# Altium project EEG_circuit.PrjPcb (part 2 of 3)
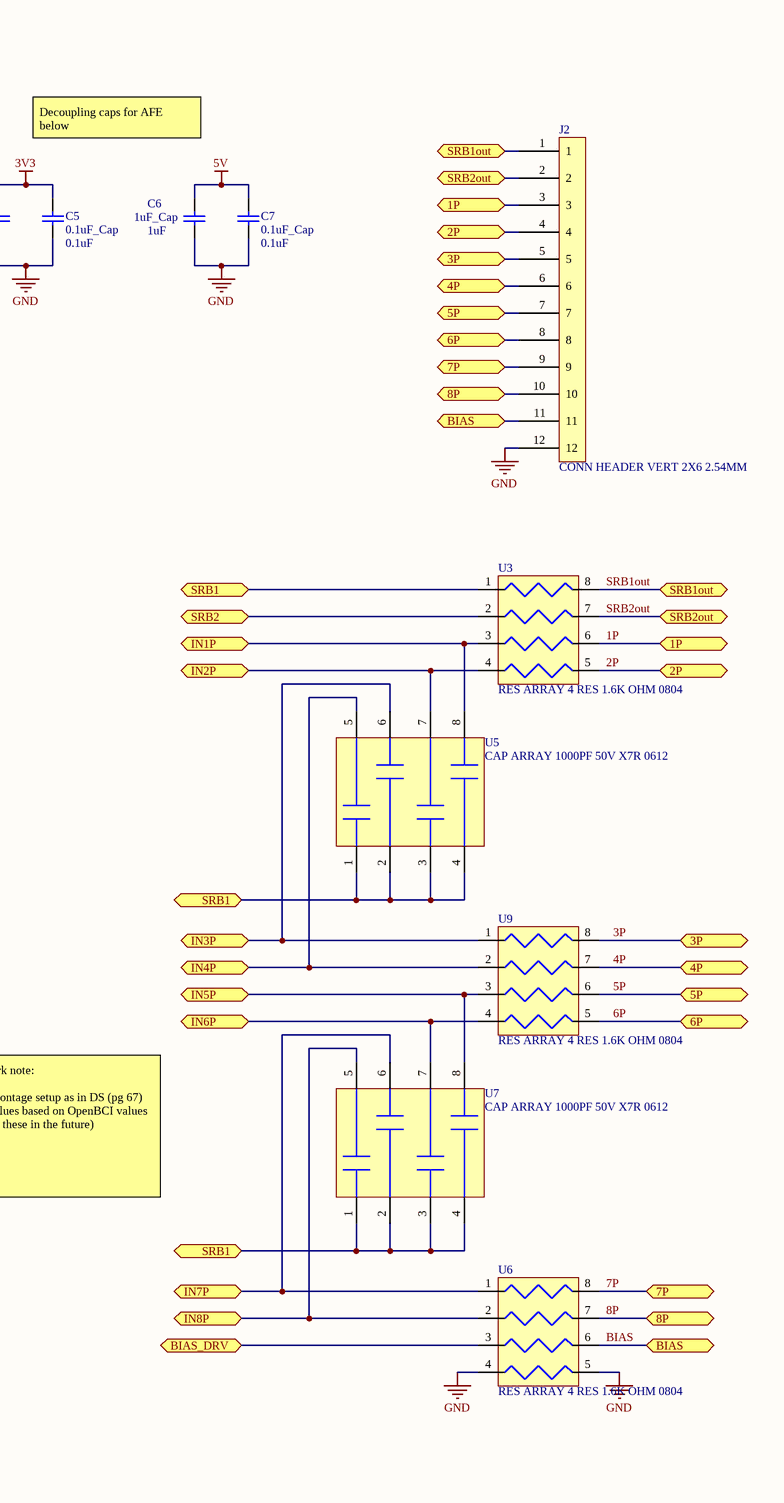
[diagram p2: EEG_schematic.SchDoc, right]

## Sheet EEG_schematic.SchDoc (continued)
### Library data of the parts
C1 C4 C6 C15 C16 = 1uF_Cap: 0402 Cap 1uF; Manufacturer: Murata; Manufacturer Part Number: GRM153R61A105ME95D; Material: Ceramic; Tolerance: 20%; Voltage Rating: 10V; Dielectric: X5R; Supplier 1: Digi-Key; Stock 1: 43822; Pricing 1: 1=0.19, 10=0.131, 100=0.0663, 500=0.04538, 1000=0.04015, 2500=0.0384, 5000=0.03491 (USD); Mount: Surface Mount; Case/Package: 0402; Weight: 0.000212oz; Case Code (Metric): 1005; Case Code (Imperial): 0402; Min Operating Temperature: -55°C; Max Operating Temperature: 85°C; Capacitance: 1uF; Packaging: Tape and Reel; Termination: SMD/SMT; Composition: Ceramic; Voltage Rating (DC): 10V; Package Quantity: 10000; Length: 1mm; Height: 0.3mm; Width: 0.5mm; Thickness: 0.013inch; REACH SVHC: No SVHC; ComponentLink1URL: http://www.farnell.com/datasheets/1666664.pdf?src-supplier=Element14; ComponentLink1Description: http://www.farnell.com/datasheets/1666664.pdf?src-supplier=Element14; Supplier Part Number 1: 490-14577-6-ND
C2 C5 C7 C10 C12 C18 = 0.1uF_Cap: 0402 Cap 0.1uF; Manufacturer: Samsung; Manufacturer Part Number: CL05A104KP5NNNC; Capacitance: 100nF; Tolerance: 10%; Voltage Rating: 10V; Dielectric: X5R; Supplier 1: Digi-Key; Stock 1: 12307534; Pricing 1: 1=0.1, 10=0.025, 100=0.0111, 500=0.00794, 1000=0.00624, 2500=0.00568, 5000=0.00522 (USD); Mount: Surface Mount; Case/Package: 0402; Case Code (Metric): 1005; Case Code (Imperial): 0402; Contact Plating: Tin; Min Operating Temperature: -55°C; Max Operating Temperature: 85°C; Packaging: Tape and Reel; Length: 1mm; Height: 0.5mm; Width: 0.02inch; Thickness: 0.022inch; Depth: 0.5mm; Radiation Hardening: No; ComponentLink1URL: https://media.digikey.com/pdf/Data%20Sheets/Samsung%20PDFs/CL_Series_MLCC_ds.pdf?src-supplier=Digi-Key; ComponentLink1Description: https://media.digikey.com/pdf/Data%20Sheets/Samsung%20PDFs/CL_Series_MLCC_ds.pdf?src-supplier=Digi-Key; ComponentLink2URL: https://www.verical.com/server-webapp/html/getDatasheet?partID=358611&src-supplier=Verical; ComponentLink2Description: https://www.verical.com/server-webapp/html/getDatasheet?partID=358611&src-supplier=Verical; ComponentLink3URL: http://www1.futureelectronics.com/doc/SAMSUNG%20PASSIVE/CL05B104KQ5NNNC.pdf?src-supplier=Future+Electronics; ComponentLink3Description: http://www1.futureelectronics.com/doc/SAMSUNG%20PASSIVE/CL05B104KQ5NNNC.pdf?src-supplier=Future+Electronics; ComponentLink4URL: https://www.distrelec.biz/Web/Downloads/_e/ng/MLCC_CatalogDownload2013_ENG.pdf?mime=application%2Fpdf&src-supplier=Distrelec; ComponentLink4Description: https://www.distrelec.biz/Web/Downloads/_e/ng/MLCC_CatalogDownload2013_ENG.pdf?mime=application%2Fpdf&src-supplier=Distrelec; Supplier Part Number 1: 1276-1022-6-ND
C3 = 1.5nF_Cap: 0402 Cap 1.5nF; Manufacturer: Samsung; Manufacturer Part Number: CL05B152KB5NNNC; Material: Ceramic; Tolerance: 10%; Voltage Rating: 50V; Dielectric: X7R; Supplier 1: Digi-Key; Stock 1: 658330; Pricing 1: 1=0.1, 10=0.023, 100=0.0101, 500=0.0072, 1000=0.00566, 2500=0.00514, 5000=0.00473 (USD); Mount: Surface Mount; Case/Package: 0402; Case Code (Metric): 1005; Case Code (Imperial): 0402; Contact Plating: Tin; Min Operating Temperature: -55°C; Max Operating Temperature: 125°C; Package Quantity: 1; Packaging: Tape and Reel; Capacitance: 1.5nF; Voltage: 50V; Length: 1mm; Height: 0.5mm; Width: 0.02inch; Thickness: 0.022inch; Depth: 0.5mm; Radiation Hardening: No; ComponentLink1URL: https://www.verical.com/server-webapp/html/getDatasheet?partID=543173&src-supplier=Verical; ComponentLink1Description: https://www.verical.com/server-webapp/html/getDatasheet?partID=543173&src-supplier=Verical; ComponentLink2URL: http://www1.futureelectronics.com/doc/SAMSUNG/CL05B152KB5NNNC.pdf?src-supplier=Future+Electronics; ComponentLink2Description: http://www1.futureelectronics.com/doc/SAMSUNG/CL05B152KB5NNNC.pdf?src-supplier=Future+Electronics; ComponentLink3URL: https://www.distrelec.biz/Web/Downloads/_e/ng/MLCC_CatalogDownload2013_ENG.pdf?mime=application%2Fpdf&src-supplier=Distrelec; ComponentLink3Description: https://www.distrelec.biz/Web/Downloads/_e/ng/MLCC_CatalogDownload2013_ENG.pdf?mime=application%2Fpdf&src-supplier=Distrelec; ComponentLink4URL: https://produktinfo.conrad.com/datenblaetter/450000-474999/459134-da-01-en-VS_KONDENSATOR_0402.pdf?src-supplier=Conrad; ComponentLink4Description: https://produktinfo.conrad.com/datenblaetter/450000-474999/459134-da-01-en-VS_KONDENSATOR_0402.pdf?src-supplier=Conrad; Supplier Part Number 1: 1276-1521-6-ND
C8 C13 C14 = 4.7uF_Cap: 0402 Cap 4.7uF; Manufacturer: Murata; Manufacturer Part Number: GRM155R61A475MEAAD; Tolerance: 20%; Voltage Rating: 10V; Supplier 1: Digi-Key; Stock 1: 848000; Pricing 1: 1=0.25, 10=0.169, 100=0.0856, 500=0.05854, 1000=0.05179, 2500=0.04954, 5000=0.04503 (USD); Mount: Surface Mount; Case/Package: 0402; Case Code (Imperial): 0402; Case Code (Metric): 1005; Min Operating Temperature: -55°C; Max Operating Temperature: 85°C; Packaging: Tape and Reel; Capacitance: 4.7uF; ComponentLink1URL: http://www.farnell.com/datasheets/2189109.pdf?src-supplier=Farnell; ComponentLink1Description: http://www.farnell.com/datasheets/2189109.pdf?src-supplier=Farnell; ComponentLink2URL: https://search.murata.co.jp/Ceramy/image/img/A01X/G101/ENG/GRM155R61A475MEAA-01.pdf?src-supplier=Digi-Key; ComponentLink2Description: https://search.murata.co.jp/Ceramy/image/img/A01X/G101/ENG/GRM155R61A475MEAA-01.pdf?src-supplier=Digi-Key; ComponentLink3URL: http://www.farnell.com/datasheets/2189109.pdf?src-supplier=Element14; ComponentLink3Description: http://www.farnell.com/datasheets/2189109.pdf?src-supplier=Element14; ComponentLink4URL: http://www.farnell.com/datasheets/2189109.pdf?src-supplier=Newark; ComponentLink4Description: http://www.farnell.com/datasheets/2189109.pdf?src-supplier=Newark; ComponentLink5URL: http://datasheet.octopart.com/GRM155R61A475MEAAD-Murata-datasheet-138740730.pdf?src-supplier=Ciiva+Crawler; ComponentLink5Description: http://datasheet.octopart.com/GRM155R61A475MEAAD-Murata-datasheet-138740730.pdf?src-supplier=Ciiva+Crawler; ComponentLink6URL: http://datasheet.octopart.com/GRM155R61A475MEAAD-Murata-datasheet-68589269.pdf?src-supplier=Newark; ComponentLink6Description: http://datasheet.octopart.com/GRM155R61A475MEAAD-Murata-datasheet-68589269.pdf?src-supplier=Newark; ComponentLink7URL: http://datasheet.octopart.com/GRM155R61A475MEAAD-Murata-datasheet-8819587.pdf; ComponentLink7Description: http://datasheet.octopart.com/GRM155R61A475MEAAD-Murata-datasheet-8819587.pdf; ComponentLink8URL: http://datasheet.octopart.com/GRM155R61A475MEAAD-Murata-datasheet-10025737.pdf; ComponentLink8Description: http://datasheet.octopart.com/GRM155R61A475MEAAD-Murata-datasheet-10025737.pdf; ComponentLink9URL: http://datasheet.octopart.com/GRM155R61A475MEAAD-Murata-datasheet-11978611.pdf; ComponentLink9Description: http://datasheet.octopart.com/GRM155R61A475MEAAD-Murata-datasheet-11978611.pdf; ComponentLink10URL: http://datasheet.octopart.com/GRM155R61A475MEAAD-Murata-datasheet-12510076.pdf; ComponentLink10Description: http://datasheet.octopart.com/GRM155R61A475MEAAD-Murata-datasheet-12510076.pdf; ComponentLink11URL: http://datasheet.octopart.com/GRM155R61A475MEAAD-Murata-datasheet-12515295.pdf; ComponentLink11Description: http://datasheet.octopart.com/GRM155R61A475MEAAD-Murata-datasheet-12515295.pdf; Supplier Part Number 1: 490-14306-6-ND
C9 C11 C17 C22 = 10uF_Cap: 0402 Cap 10uF; Manufacturer: Samsung; Manufacturer Part Number: CL05A106MP5NUNC; Tolerance: 20%; Voltage Rating: 10V; Dielectric: X5R; Supplier 1: Digi-Key; Stock 1: 3276370; Pricing 1: 1=0.42, 10=0.295, 100=0.1943, 500=0.14392, 1000=0.12233, 2500=0.11514, 5000=0.10794 (USD); Mount: Surface Mount; Case/Package: 0402; Case Code (Metric): 1005; Case Code (Imperial): 0402; Contact Plating: Tin; Min Operating Temperature: -55°C; Max Operating Temperature: 85°C; Package Quantity: 1; Packaging: Tape and Reel; Capacitance: 10uF; Termination: Wraparound; Length: 1mm; Width: 0.02inch; Thickness: 0.028inch; Depth: 0.5mm; Radiation Hardening: No; Lead Free: Lead Free; ComponentLink1URL: https://media.digikey.com/pdf/Data%20Sheets/Samsung%20PDFs/CL_Series_MLCC_ds.pdf?src-supplier=Digi-Key; ComponentLink1Description: https://media.digikey.com/pdf/Data%20Sheets/Samsung%20PDFs/CL_Series_MLCC_ds.pdf?src-supplier=Digi-Key; ComponentLink2URL: https://www.verical.com/server-webapp/html/getDatasheet?partID=745310&src-supplier=Verical; ComponentLink2Description: https://www.verical.com/server-webapp/html/getDatasheet?partID=745310&src-supplier=Verical; Supplier Part Number 1: 1276-1450-6-ND
C19 C23 = 100uF_Cap: 1206 Cap 100uF; Manufacturer: Murata; Manufacturer Part Number: GRM31CR60J107ME39L; Material: Ceramic; Tolerance: 20%; Voltage Rating: 6.3V; Dielectric: X5R; Supplier 1: Digi-Key; Stock 1: 1307168; Pricing 1: 1=1.08, 10=0.852, 100=0.6386, 500=0.48254, 1000=0.42577 (USD); Mount: Surface Mount; Case/Package: 1206; Case Code (Imperial): 1206; Case Code (Metric): 3216; Min Operating Temperature: -55°C; Max Operating Temperature: 85°C; Capacitance: 100uF; Packaging: Tape and Reel; Voltage Rating (DC): 6.3V; Package Quantity: 1; Termination: SMD/SMT; Voltage: 6.3V; Length: 3.2mm; Height: 1.6mm; Width: 1.6mm; Thickness: 0.071inch; Depth: 1.6mm; Radiation Hardening: No; REACH SVHC: No SVHC; Lead Free: Lead Free; ComponentLink1URL: http://uk.rs-online.com/webdocs/1388/0900766b813885c5.pdf?src-supplier=RSComponents; ComponentLink1Description: http://uk.rs-online.com/webdocs/1388/0900766b813885c5.pdf?src-supplier=RSComponents; ComponentLink2URL: http://components.arrow.com/part/dataview/42788059S8888100N2606?src-supplier=Arrow; ComponentLink2Description: http://components.arrow.com/part/dataview/42788059S8888100N2606?src-supplier=Arrow; ComponentLink3URL: http://www.mouser.com/ds/2/281/c02e-2905.pdf?src-supplier=Mouser; ComponentLink3Description: http://www.mouser.com/ds/2/281/c02e-2905.pdf?src-supplier=Mouser; ComponentLink4URL: https://www.murata.com/~/media/webrenewal/support/library/catalog/products/capacitor/mlcc/c02e.ashx?la=en-us&src-supplier=Digi-Key; ComponentLink4Description: https://www.murata.com/~/media/webrenewal/support/library/catalog/products/capacitor/mlcc/c02e.ashx?la=en-us&src-supplier=Digi-Key; ComponentLink5URL: http://psearch.murata.com/capacitor/product/GRM31CF51A226ZE01%23.pdf?src-supplier=Future+Electronics; ComponentLink5Description: http://psearch.murata.com/capacitor/product/GRM31CF51A226ZE01%23.pdf?src-supplier=Future+Electronics; ComponentLink6URL: https://www.distrelec.biz/Web/Downloads/_t/ds/murata_MLCC_eng_tds.pdf?mime=application%2Fpdf&src-supplier=Distrelec; ComponentLink6Description: https://www.distrelec.biz/Web/Downloads/_t/ds/murata_MLCC_eng_tds.pdf?mime=application%2Fpdf&src-supplier=Distrelec; ComponentLink7URL: http://www.produktinfo.conrad.com/datenblaetter/450000-474999/454804-da-01-en-VS_KONDENSATOR_1206.pdf?src-supplier=Conrad; ComponentLink7Description: http://www.produktinfo.conrad.com/datenblaetter/450000-474999/454804-da-01-en-VS_KONDENSATOR_1206.pdf?src-supplier=Conrad; ComponentLink8URL: http://www.produktinfo.conrad.com/datenblaetter/450000-474999/451152-da-01-de-VS_CHIP_KOND_1206_100_0_UF_20Pr_6_3V_X5R.pdf?src-supplier=Conrad; ComponentLink8Description: http://www.produktinfo.conrad.com/datenblaetter/450000-474999/451152-da-01-de-VS_CHIP_KOND_1206_100_0_UF_20Pr_6_3V_X5R.pdf?src-supplier=Conrad; Supplier Part Number 1: 490-4539-6-ND
C20 C21 = 18pF_Cap: 0402 Cap 18pF; Manufacturer: KEMET; Manufacturer Part Number: C0402C180K5RAC7867; Supplier 1: Digi-Key; Stock 1: 3569; Pricing 1: 1=0.21, 10=0.142, 100=0.0721, 500=0.04934, 1000=0.04364, 2500=0.04174, 5000=0.03795 (USD); Supplier Part Number 1: 399-19371-6-ND; ComponentLink1Description: digikey link; ComponentLink1URL: https://www.digikey.ca/product-detail/en/kemet/C0402C180K5RAC7867/399-19371-1-ND/9694278
D1 = GSOT04C-G3-08: TVS Diode Arrays 4.0 Volt 300 Watt Common Anode; Manufacturer: Vishay Semiconductors; Capacitance: 200pF; Polarity: Bidirectional; Number of Channels: 2; Breakdown Voltage: 6.1V; Clamping Voltage: 14.3V; Peak Pulse Power: 429W; Reverse Standoff Voltage: 4V; Min Breakdown Voltage: 5V; Power Line Protection: No; Peak Pulse Current: 30A; Supplier 1: Digi-Key; Manufacturer Part Number: GSOT04C-G3-08; Stock 1: 3725; Pricing 1: 1=0.43, 10=0.324, 25=0.2916, 100=0.1538, 250=0.15224, 500=0.13634, 1000=0.1061 (USD); Mount: Surface Mount; Case/Package: TO-236-3; Weight: 0.00031oz; Min Operating Temperature: -55°C; Max Operating Temperature: 150°C; Packaging: Tape and Reel; Termination: SMD/SMT; Number of Unidirectional Channels: 2; Composition: Zener; ComponentLink1URL: http://www.mouser.com/ds/2/427/gsot03c-243311.pdf?src-supplier=Mouser; ComponentLink1Description: http://www.mouser.com/ds/2/427/gsot03c-243311.pdf?src-supplier=Mouser; ComponentLink2URL: http://www.vishay.com/docs/85824/gsot03c.pdf?src-supplier=Digi-Key; ComponentLink2Description: http://www.vishay.com/docs/85824/gsot03c.pdf?src-supplier=Digi-Key; Supplier Part Number 1: GSOT04C-G3-08GIDKR-ND
D2 = LED1: LED BLUE CLEAR CHIP SMD; Manufacturer: Vishay Lite-On; Manufacturer Part Number: LTST-C193TBKT-5A; Lens Color: Colorless; Forward Current: 20mA; Forward Voltage: 2.8V; Luminous Intensity: 15mcd; Viewing Angle: 130°; Lens Style: Diffused,Colorless,Rectangular,Clear; Dominant Wavelength: 475nm; Test Current: 5mA; Number of Elements: 1; Power Dissipation: 76mW; Reverse Voltage: 5V; Published: 8-Jun-2000; LatestRevisionDate: 08-Jul-2005; LatestRevisionNote: Mech Layer 1 removed.; PackageReference: LED-1; Publisher: Altium Limited; PackageDescription: LED; 2 Leads; Supplier 1: Digi-Key; Supplier Part Number 1: 160-1827-1-ND; Stock 1: 40029; Pricing 1: 1=0.45, 10=0.32, 100=0.1424, 500=0.09968, 1000=0.08188, 2500=0.0712 (USD); Mount: Surface Mount; Case/Package: 0603; Number of Pins: 2; Color: Blue; Case Code (Metric): 1608; Case Code (Imperial): 0603; Min Operating Temperature: -20°C; Max Operating Temperature: 80°C; Packaging: Tape and Reel; Package Quantity: 1; Illumination Color: Blue; Lens Transparency: Clear; Number of LEDs: 1; Length: 1.6mm; Height: 0.35mm; Width: 0.8mm; Depth: 0.8mm; Radiation Hardening: No; Lead Free: Lead Free; ComponentLink1URL: http://www.mouser.com/ds/2/239/Lite-On-LTST-C193TBKT-5A-187386.pdf?src-supplier=Mouser; ComponentLink1Description: http://www.mouser.com/ds/2/239/Lite-On-LTST-C193TBKT-5A-187386.pdf?src-supplier=Mouser; ComponentLink2URL: https://media.digikey.com/pdf/Data%20Sheets/Lite-On%20PDFs/LTST-C193TBKT-5A.pdf?src-supplier=Digi-Key; ComponentLink2Description: https://media.digikey.com/pdf/Data%20Sheets/Lite-On%20PDFs/LTST-C193TBKT-5A.pdf?src-supplier=Digi-Key; ComponentLink3URL: https://www.verical.com/server-webapp/html/getDatasheet?partID=293056&src-supplier=Verical; ComponentLink3Description: https://www.verical.com/server-webapp/html/getDatasheet?partID=293056&src-supplier=Verical; ComponentLink4URL: http://uk.rs-online.com/webdocs/0dc0/0900766b80dc0554.pdf?src-supplier=RSComponents; ComponentLink4Description: http://uk.rs-online.com/webdocs/0dc0/0900766b80dc0554.pdf?src-supplier=RSComponents; ComponentLink5URL: http://www1.futureelectronics.com/doc/LITE-ON/LTST-C193TBKT-5A.pdf?src-supplier=Future+Electronics; ComponentLink5Description: http://www1.futureelectronics.com/doc/LITE-ON/LTST-C193TBKT-5A.pdf?src-supplier=Future+Electronics
J1 = B2B-PH-SM4-TBT(LF)(SN): Manufacturer: JST; Number of Positions: 2; Connector Type: Male Pin; Pitch: 0.079inch; Supplier 1: Digi-Key; Manufacturer Part Number: B2B-PH-SM4-TBT(LF)(SN); Stock 1: 6672; Pricing 1: 1=0.82, 10=0.768, 100=0.5888, 500=0.51202 (USD); Mount: Surface Mount; Color: Natural; Contact Plating: Tin; Packaging: Cut Tape; Number of Rows: 1; Package Quantity: 1; Fastening Type: Detent; Termination: Solder; Contact Mating Length: 0.13inch; Lead Free: Lead Free; ComponentLink1URL: https://www.verical.com/server-webapp/html/getDatasheet?partID=473167&src-supplier=Verical; ComponentLink1Description: https://www.verical.com/server-webapp/html/getDatasheet?partID=473167&src-supplier=Verical; ComponentLink2URL: http://www.jst-mfg.com/product/pdf/eng/ePH.pdf?src-supplier=Digi-Key; ComponentLink2Description: http://www.jst-mfg.com/product/pdf/eng/ePH.pdf?src-supplier=Digi-Key; Supplier Part Number 1: 455-2872-6-ND
J2 = 61301211121: WURTH ELEKTRONIK         61301211121            Board-To-Board Connector, Vertical, WR-PHD Series, Through Hole, Header, 12 Contacts, 2.54 mm; Manufacturer: Wurth Electronics; Number of Positions: 12; Gender: Male; Connector Type: Male Pin; Pitch: 0.1inch; Supplier 1: Digi-Key; Manufacturer Part Number: 61301211121; Stock 1: 334; Pricing 1: 1=0.54, 10=0.454, 25=0.3792, 50=0.316, 100=0.287, 1000=0.261 (USD); Mount: Through Hole; Contact Plating: Gold; Contact Material: Copper; Color: Black; Number of Rows: 1; Packaging: Bulk; Termination: Solder; Number of Contacts: 12; Contact Mating Length: 0.236inch; REACH SVHC: Unknown; ComponentLink1URL: http://www.farnell.com/cad/1737268.pdf?src-supplier=Element14; ComponentLink1Description: http://www.farnell.com/cad/1737268.pdf?src-supplier=Element14; ComponentLink2URL: https://katalog.we-online.de/em/datasheet/6130xx11121.pdf?src-supplier=Digi-Key; ComponentLink2Description: https://katalog.we-online.de/em/datasheet/6130xx11121.pdf?src-supplier=Digi-Key; Supplier Part Number 1: 732-5323-ND
J3 = MEM2067-02-180-00-A: GLOBAL CONNECTOR TECHNOLOGY         MEM2067-02-180-00-A             MEMORY CARD CONNECTOR, 8 POSITION; Number of Contacts: 8; Supplier 1: Digi-Key; Manufacturer: Global Connector Technology; Manufacturer Part Number: MEM2067-02-180-00-A; Stock 1: 0; Mount: Socket; Contact Material: Copper Alloy; Contact Plating: Gold; REACH SVHC: No SVHC; Lead Free: Lead Free; ComponentLink1URL: http://www.farnell.com/datasheets/1876941.pdf?src-supplier=Element14; ComponentLink1Description: http://www.farnell.com/datasheets/1876941.pdf?src-supplier=Element14; ComponentLink2URL: http://www.farnell.com/datasheets/1876941.pdf?src-supplier=Farnell; ComponentLink2Description: http://www.farnell.com/datasheets/1876941.pdf?src-supplier=Farnell; Supplier Part Number 1: 2073-MEM2067-02-180-00-ACT-ND
J4 = 61300621121: WURTH ELEKTRONIK         61300621121            Board-To-Board Connector, Vertical, WR-PHD Series, Through Hole, Header, 6 Contacts, 2.54 mm; Manufacturer: Wurth Electronics; Number of Positions: 6; Gender: Male; Connector Type: Male Pin; Pitch: 0.1inch; Supplier 1: Digi-Key; Manufacturer Part Number: 61300621121; Stock 1: 2655; Pricing 1: 1=0.54, 10=0.454, 25=0.3792, 50=0.316, 100=0.287, 1000=0.261 (USD); Mount: Through Hole; Contact Plating: Gold; Contact Material: Copper; Color: Black; Number of Rows: 2; Packaging: Bulk; Termination: Solder; Number of Contacts: 6; Row Spacing: 0.1inch; Contact Mating Length: 0.236inch; REACH SVHC: Unknown; ComponentLink1URL: http://www.farnell.com/datasheets/1442180.pdf?src-supplier=Element14; ComponentLink1Description: http://www.farnell.com/datasheets/1442180.pdf?src-supplier=Element14; Supplier Part Number 1: 732-5295-ND
L1 = 2_2uH_Inductor: FIXED IND 2.2UH 500MA 250 MOHM; Manufacturer: TDK; Manufacturer Part Number: MLZ1608A2R2WT000; Core Material: Ferrite; Tolerance: 20%; Saturation Current: 130mA; Shielding: Shielded; DC Resistance (DCR): 325mR; Self Resonant Frequency: 120MHz; Test Frequency: 10MHz; Supplier 1: Digi-Key; Stock 1: 11492; Pricing 1: 1=0.17, 10=0.155, 100=0.1035, 500=0.08626, 1000=0.07245 (USD); Mount: Surface Mount; Case/Package: 0603; Case Code (Metric): 1608; Case Code (Imperial): 0603; Min Operating Temperature: -55°C; Max Operating Temperature: 125°C; Package Quantity: 4000; Packaging: Tape and Reel; Current Rating: 500mA; Inductance: 2.2uH; Length: 0.063inch; Width: 0.031inch; Height - Seated (Max): 0.037inch; Lead Free: Lead Free; ComponentLink1URL: https://product.tdk.com/info/en/catalog/datasheets/inductor_commercial_decoupling_mlz1608_en.pdf?src-supplier=Digi-Key; ComponentLink1Description: https://product.tdk.com/info/en/catalog/datasheets/inductor_commercial_decoupling_mlz1608_en.pdf?src-supplier=Digi-Key; Supplier Part Number 1: 445-6385-6-ND
L2 = 4_7uH_Inductor: Inductor; Manufacturer: TDK; Manufacturer Part Number: MLZ1608M4R7WT000; Core Material: Ferrite; Tolerance: 20%; Current Rating: 350mA; Saturation Current: 120mA; Shielding: Shielded; DC Resistance (DCR): 650mR; Test Frequency: 2MHz; Self Resonant Frequency: 80MHz; Supplier 1: Digi-Key; Stock 1: 1557; Pricing 1: 1=0.17, 10=0.155, 100=0.1035, 500=0.08626, 1000=0.07245 (USD); Mount: Surface Mount; Case/Package: 0603; Case Code (Metric): 1608; Case Code (Imperial): 0603; Min Operating Temperature: -55°C; Max Operating Temperature: 125°C; Package Quantity: 4000; Packaging: Tape and Reel; Inductance: 4.7uH; Length: 0.063inch; Width: 0.031inch; Height - Seated (Max): 0.037inch; ComponentLink1URL: https://product.tdk.com/info/en/catalog/datasheets/inductor_commercial_decoupling_mlz1608_en.pdf?src-supplier=Digi-Key; ComponentLink1Description: https://product.tdk.com/info/en/catalog/datasheets/inductor_commercial_decoupling_mlz1608_en.pdf?src-supplier=Digi-Key; Supplier Part Number 1: 445-6390-6-ND
R1 R16 = 1M_Res: RES SMD 1M OHM 1% 1/16W 0402; Manufacturer: Yageo; Manufacturer Part Number: RC0402FR-071ML; Resistance: 1MR; Power Rating: 63mW; Voltage Rating: 50V; Temperature Coefficient: 100ppm/°C; Supplier 1: Digi-Key; Stock 1: 10014545; Pricing 1: 1=0.1, 10=0.016, 100=0.0064, 1000=0.00289, 2500=0.00251, 5000=0.00207 (USD); Case/Package: 0402; Case Code (Imperial): 0402; Case Code (Metric): 1005; Min Operating Temperature: -55°C; Max Operating Temperature: 155°C; Packaging: Tape and Reel; Tolerance: 1%; Termination: SMD/SMT; Composition: Thick Film; Military Standard: Not; Length: 1mm; Height: 0.32mm; Depth: 0.5mm; REACH SVHC: Unknown; Lead Free: Lead Free; ComponentLink1URL: http://www.farnell.com/datasheets/1018594.pdf?src-supplier=Element14; ComponentLink1Description: http://www.farnell.com/datasheets/1018594.pdf?src-supplier=Element14; ComponentLink2URL: http://www.yageo.com/documents/recent/PYu-RC0402_51_RoHS_L_6_r.pdf?src-supplier=Future+Electronics; ComponentLink2Description: http://www.yageo.com/documents/recent/PYu-RC0402_51_RoHS_L_6_r.pdf?src-supplier=Future+Electronics; ComponentLink3URL: http://www.farnell.com/datasheets/2167052.pdf?src-supplier=Element14; ComponentLink3Description: http://www.farnell.com/datasheets/2167052.pdf?src-supplier=Element14; Supplier Part Number 1: 311-1.00MLRCT-ND
R2 R3 = 0_Res: RES SMD 0 OHM JUMPER 1/16W 0402; Manufacturer: Yageo; Manufacturer Part Number: RC0402JR-070RL; Resistance: 0mR; Power Rating: 62.5mW; Tolerance: 5%; Voltage Rating: 50V; Max Power Dissipation: 63mW; Temperature Coefficient: 200ppm/°C; Supplier 1: Digi-Key; Stock 1: 50001357; Pricing 1: 1=0.1, 10=0.013, 25=0.0092, 50=0.0072, 100=0.0053, 250=0.004, 500=0.0032, 1000=0.00236, 5000=0.00169 (USD); Case/Package: 0402; Contact Plating: Tin,Matte; Case Code (Metric): 1005; Case Code (Imperial): 0402; Min Operating Temperature: -55°C; Max Operating Temperature: 155°C; Packaging: Tape and Reel; Composition: Thick Film; Package Quantity: 1; Number of Terminations: 2; Termination: SMD/SMT; Military Standard: Not; Features: Moisture Resistant; Length: 1mm; Height: 0.016inch; Width: 0.02inch; Depth: 0.5mm; Radiation Hardening: No; REACH SVHC: Unknown; Lead Free: Lead Free; ComponentLink1URL: http://www.yageo.com/documents/recent/PYu-RC_Group_51_RoHS_L_10.pdf?src-supplier=Digi-Key; ComponentLink1Description: http://www.yageo.com/documents/recent/PYu-RC_Group_51_RoHS_L_10.pdf?src-supplier=Digi-Key; ComponentLink2URL: http://www.yageo.com/documents/recent/PYu-RC0402_51_RoHS_L_6.pdf?src-supplier=Avnet+Europe; ComponentLink2Description: http://www.yageo.com/documents/recent/PYu-RC0402_51_RoHS_L_6.pdf?src-supplier=Avnet+Europe; ComponentLink3URL: http://www.farnell.com/datasheets/1018594.pdf?src-supplier=Element14; ComponentLink3Description: http://www.farnell.com/datasheets/1018594.pdf?src-supplier=Element14; ComponentLink4URL: https://www.verical.com/server-webapp/html/getDatasheet?partID=326379&src-supplier=Verical; ComponentLink4Description: https://www.verical.com/server-webapp/html/getDatasheet?partID=326379&src-supplier=Verical; ComponentLink5URL: http://www.farnell.com/datasheets/2167052.pdf?src-supplier=Element14; ComponentLink5Description: http://www.farnell.com/datasheets/2167052.pdf?src-supplier=Element14; Supplier Part Number 1: 311-0.0JRDKR-ND
R4 = 453k_Res: RES SMD 453K OHM 1% 1/16W 0402; Manufacturer: Yageo; Manufacturer Part Number: RC0402FR-07453KL; Resistance: 453kR; Power Rating: 62.5mW; Voltage Rating: 50V; Max Power Dissipation: 63mW; Temperature Coefficient: 100ppm/°C; Supplier 1: Digi-Key; Stock 1: 641723; Pricing 1: 1=0.1, 10=0.016, 100=0.0064, 1000=0.00289, 2500=0.00251, 5000=0.00207 (USD); Case/Package: 0402; Case Code (Imperial): 0402; Case Code (Metric): 1005; Contact Plating: Tin,Matte; Min Operating Temperature: -55°C; Max Operating Temperature: 155°C; Tolerance: 1%; Packaging: Tape and Reel; Composition: Thick Film; Number of Terminations: 2; Termination: SMD/SMT; Military Standard: Not; Voltage Rating (DC): 50V; Features: Moisture Resistant; Length: 1mm; Height: 0.016inch; Width: 0.02inch; Depth: 0.5mm; Lead Free: Lead Free; ComponentLink1URL: http://www.yageo.com/documents/recent/PYu-RC0402_51_RoHS_L_6_r.pdf?src-supplier=Future+Electronics; ComponentLink1Description: http://www.yageo.com/documents/recent/PYu-RC0402_51_RoHS_L_6_r.pdf?src-supplier=Future+Electronics; ComponentLink2URL: https://www.verical.com/server-webapp/html/getDatasheet?partID=325135&src-supplier=Verical; ComponentLink2Description: https://www.verical.com/server-webapp/html/getDatasheet?partID=325135&src-supplier=Verical; ComponentLink3URL: http://www.yageo.com/documents/recent/PYu-RC0402_51_RoHS_L_6.pdf?src-supplier=Avnet; ComponentLink3Description: http://www.yageo.com/documents/recent/PYu-RC0402_51_RoHS_L_6.pdf?src-supplier=Avnet; ComponentLink4URL: http://www.yageo.com/documents/recent/PYu-RC0402_51_RoHS_L_6.pdf?src-supplier=Avnet+Europe; ComponentLink4Description: http://www.yageo.com/documents/recent/PYu-RC0402_51_RoHS_L_6.pdf?src-supplier=Avnet+Europe; Supplier Part Number 1: YAG3164DKR-ND
R5-R8 R11 = 100k_Res: RES SMD 100K OHM 1% 1/16W 0402; Manufacturer: Yageo; Manufacturer Part Number: RC0402FR-07100KL; Resistance: 100kR; Temperature Coefficient: 100ppm/°C; Power Rating: 63mW; Voltage Rating: 50V; Published: 8-Jun-2000; LatestRevisionDate: 17-Jul-2002; LatestRevisionNote: Re-released for DXP Platform.; PackageReference: AXIAL-0.3; Publisher: Altium Limited; PackageDescription: Axial Device, Thru-Hole; 2 Leads; 0.3 in Pin Spacing; Supplier 1: Digi-Key; Stock 1: 46714463; Pricing 1: 1=0.1, 10=0.016, 100=0.0064, 1000=0.00289, 2500=0.00251, 5000=0.00207 (USD); Case/Package: 0402; Case Code (Metric): 1005; Case Code (Imperial): 0402; Min Operating Temperature: -55°C; Max Operating Temperature: 155°C; Tolerance: 1%; Packaging: Tape and Reel; Composition: Thick Film; Termination: SMD/SMT; Military Standard: Not; Number of Terminations: 2; Working Voltage: 50V; Package Quantity: 1; Max Power Dissipation: 63mW; Features: Moisture Resistant; Length: 0.039inch; Height: 0.016inch; Width: 0.02inch; Depth: 0.5mm; REACH SVHC: No SVHC; Lead Free: Lead Free; ComponentLink1URL: http://www.yageo.com/documents/recent/PYu-RC_Group_51_RoHS_L_10.pdf?src-supplier=Digi-Key; ComponentLink1Description: http://www.yageo.com/documents/recent/PYu-RC_Group_51_RoHS_L_10.pdf?src-supplier=Digi-Key; ComponentLink2URL: http://www.farnell.com/datasheets/1018594.pdf?src-supplier=Element14; ComponentLink2Description: http://www.farnell.com/datasheets/1018594.pdf?src-supplier=Element14; ComponentLink3URL: http://www.yageo.com/documents/recent/PYu-RC_Group_51_RoHS_L_9.pdf?src-supplier=Verical; ComponentLink3Description: http://www.yageo.com/documents/recent/PYu-RC_Group_51_RoHS_L_9.pdf?src-supplier=Verical; ComponentLink4URL: http://www.yageo.com/documents/recent/PYu-RC_Group_51_RoHS_L_9.pdf?src-supplier=Mouser; ComponentLink4Description: http://www.yageo.com/documents/recent/PYu-RC_Group_51_RoHS_L_9.pdf?src-supplier=Mouser; ComponentLink5URL: http://documents.rs-components.com/techlib://itc_doclist_GB.htm?stockno=6185797&src-supplier=RSComponents; ComponentLink5Description: http://documents.rs-components.com/techlib://itc_doclist_GB.htm?stockno=6185797&src-supplier=RSComponents; Supplier Part Number 1: 311-100KLRCT-ND
R9 = 1_6M_Res: RES SMD 1.6M OHM 5% 1/16W 0402; Manufacturer: Yageo; Manufacturer Part Number: RC0402JR-071M6L; Resistance: 1.6MR; Max Power Dissipation: 63mW; Temperature Coefficient: 100ppm/°C; Supplier 1: Digi-Key; Stock 1: 10969; Pricing 1: 1=0.1, 10=0.013, 100=0.0053, 1000=0.00236, 2500=0.00205, 5000=0.00169 (USD); Case/Package: 0402; Case Code (Metric): 1005; Case Code (Imperial): 0402; Contact Plating: Tin,Matte; Min Operating Temperature: -55°C; Max Operating Temperature: 155°C; Tolerance: 5%; Packaging: Tape and Reel; Composition: Thick Film; Number of Terminations: 2; Military Standard: Not; Features: Moisture Resistant; Length: 0.039inch; Height: 0.016inch; Width: 0.02inch; Depth: 0.5mm; Radiation Hardening: No; ComponentLink1URL: http://www.yageo.com/documents/recent/PYu-RC0402_51_RoHS_L_6.pdf?src-supplier=Avnet; ComponentLink1Description: http://www.yageo.com/documents/recent/PYu-RC0402_51_RoHS_L_6.pdf?src-supplier=Avnet; ComponentLink2URL: http://www.yageo.com/documents/recent/PYu-RC0402_51_RoHS_L_6.pdf?src-supplier=Avnet+Europe; ComponentLink2Description: http://www.yageo.com/documents/recent/PYu-RC0402_51_RoHS_L_6.pdf?src-supplier=Avnet+Europe; Supplier Part Number 1: YAG3284DKR-ND
R10 = 180k_Res: RES SMD 180K OHM 5% 1/16W 0402; Manufacturer: Yageo; Manufacturer Part Number: RC0402JR-07180KL; Resistance: 180kR; Power Rating: 63mW; Voltage Rating: 50V; Temperature Coefficient: 100ppm/°C; Supplier 1: Digi-Key; Stock 1: 33910; Pricing 1: 1=0.1, 10=0.013, 100=0.0053, 1000=0.00236, 2500=0.00205, 5000=0.00169 (USD); Case/Package: 0402; Number of Pins: 2; Case Code (Imperial): 0402; Case Code (Metric): 1005; Min Operating Temperature: -55°C; Max Operating Temperature: 155°C; Tolerance: 5%; Voltage Rating (DC): 50V; Packaging: Tape and Reel; Package Quantity: 1; Termination: SMD/SMT; Composition: Thick Film; Number of Terminations: 2; Military Standard: Not; Max Power Dissipation: 63mW; Features: Moisture Resistant; Length: 1mm; Height: 0.016inch; Width: 0.5mm; Depth: 0.5mm; REACH SVHC: Unknown; Lead Free: Lead Free; ComponentLink1URL: http://www.farnell.com/datasheets/1018594.pdf?src-supplier=Farnell; ComponentLink1Description: http://www.farnell.com/datasheets/1018594.pdf?src-supplier=Farnell; ComponentLink2URL: http://www.yageo.com/documents/recent/PYu-RC0402_51_RoHS_L_6_r.pdf?src-supplier=Future+Electronics; ComponentLink2Description: http://www.yageo.com/documents/recent/PYu-RC0402_51_RoHS_L_6_r.pdf?src-supplier=Future+Electronics; ComponentLink3URL: http://www.farnell.com/datasheets/1018594.pdf?src-supplier=Element14; ComponentLink3Description: http://www.farnell.com/datasheets/1018594.pdf?src-supplier=Element14; ComponentLink4URL: http://www.yageo.com/documents/recent/PYu-RC_Group_51_RoHS_L_9.pdf?src-supplier=Digi-Key; ComponentLink4Description: http://www.yageo.com/documents/recent/PYu-RC_Group_51_RoHS_L_9.pdf?src-supplier=Digi-Key; ComponentLink5URL: http://www.yageo.com.tw/exep/pages/download/literatures/PYu-R_INT-thick_7.pdf?src-supplier=Digi-Key; ComponentLink5Description: http://www.yageo.com.tw/exep/pages/download/literatures/PYu-R_INT-thick_7.pdf?src-supplier=Digi-Key; Supplier Part Number 1: 311-180KJRDKR-ND
R12 = 10k_Res: RES SMD 10K OHM 1% 1/16W 0402; Manufacturer: Yageo; Manufacturer Part Number: RC0402FR-0710KL; Resistance: 10kR; Temperature Coefficient: 100ppm/°C; Voltage Rating: 50V; Power Rating: 62.5mW; Supplier 1: Digi-Key; Stock 1: 49944724; Pricing 1: 1=0.1, 10=0.016, 100=0.0064, 1000=0.00289, 2500=0.00251, 5000=0.00207 (USD); Case/Package: 0402; Number of Pins: 2; Case Code (Imperial): 0402; Case Code (Metric): 1005; Min Operating Temperature: -55°C; Max Operating Temperature: 155°C; Tolerance: 1%; Packaging: Tape and Reel; Composition: Thick Film; Voltage Rating (DC): 50V; Termination: SMD/SMT; Military Standard: Not; Working Voltage: 50V; Number of Terminations: 2; Length: 1mm; Height: 0.32mm; Width: 0.5mm; Depth: 0.5mm; Lead Pitch: 0.2mm; REACH SVHC: No SVHC; Lead Free: Lead Free; ComponentLink1URL: http://www.farnell.com/datasheets/2167052.pdf?src-supplier=Element14; ComponentLink1Description: http://www.farnell.com/datasheets/2167052.pdf?src-supplier=Element14; ComponentLink2URL: http://www.farnell.com/datasheets/1686128.pdf?src-supplier=Element14; ComponentLink2Description: http://www.farnell.com/datasheets/1686128.pdf?src-supplier=Element14; ComponentLink3URL: http://www.farnell.com/datasheets/1784430.pdf?src-supplier=Element14; ComponentLink3Description: http://www.farnell.com/datasheets/1784430.pdf?src-supplier=Element14; ComponentLink4URL: http://www.yageo.com/documents/recent/PYu-RC_Group_51_RoHS_L_9.pdf?src-supplier=Mouser; ComponentLink4Description: http://www.yageo.com/documents/recent/PYu-RC_Group_51_RoHS_L_9.pdf?src-supplier=Mouser; Supplier Part Number 1: 311-10.0KLRCT-ND
R13 R15 = 1k_Res: RES SMD 1K OHM 1% 1/16W 0402; Manufacturer: Yageo; Manufacturer Part Number: RC0402FR-071KL; Resistance: 1kR; Power Rating: 62.5mW; Voltage Rating: 50V; Temperature Coefficient: 100ppm/°C; Supplier 1: Digi-Key; Stock 1: 39206337; Pricing 1: 1=0.1, 10=0.016, 100=0.0064, 1000=0.00289, 2500=0.00251, 5000=0.00207 (USD); Case/Package: 0402; Number of Pins: 2; Case Code (Imperial): 0402; Case Code (Metric): 1005; Min Operating Temperature: -55°C; Max Operating Temperature: 155°C; Tolerance: 1%; Packaging: Tape and Reel; Composition: Thick Film; Voltage Rating (DC): 50V; Termination: SMD/SMT; Military Standard: Not; Length: 1mm; Height: 0.32mm; Width: 0.5mm; Depth: 0.5mm; REACH SVHC: Unknown; Lead Free: Lead Free; ComponentLink1URL: http://documents.rs-components.com/techlib://itc_doclist_GB.htm?stockno=6186122&src-supplier=RSComponents; ComponentLink1Description: http://documents.rs-components.com/techlib://itc_doclist_GB.htm?stockno=6186122&src-supplier=RSComponents; ComponentLink2URL: http://www.mouser.com/ds/2/447/PYu-RC0402_51_RoHS_L_6_r-8721.pdf?src-supplier=Mouser; ComponentLink2Description: http://www.mouser.com/ds/2/447/PYu-RC0402_51_RoHS_L_6_r-8721.pdf?src-supplier=Mouser; ComponentLink3URL: http://www.yageo.com/documents/recent/PYu-RC0402_51_RoHS_L_6_r.pdf?src-supplier=Future+Electronics; ComponentLink3Description: http://www.yageo.com/documents/recent/PYu-RC0402_51_RoHS_L_6_r.pdf?src-supplier=Future+Electronics; ComponentLink4URL: http://www.farnell.com/datasheets/1018594.pdf?src-supplier=Element14; ComponentLink4Description: http://www.farnell.com/datasheets/1018594.pdf?src-supplier=Element14; ComponentLink5URL: http://www.farnell.com/datasheets/2167052.pdf?src-supplier=Element14; ComponentLink5Description: http://www.farnell.com/datasheets/2167052.pdf?src-supplier=Element14; Supplier Part Number 1: 311-1.00KLRCT-ND
R14 = 470k_Res: RES SMD 470K OHM 5% 1/16W 0402; Manufacturer: Yageo; Manufacturer Part Number: RC0402JR-07470KL; Power Rating: 62.5mW; Voltage Rating: 50V; Temperature Coefficient: 100ppm/°C; Max Power Dissipation: 63mW; Resistance: 470kR; Supplier 1: Digi-Key; Stock 1: 1646167; Pricing 1: 1=0.1, 10=0.013, 100=0.0053, 1000=0.00236, 2500=0.00205, 5000=0.00169 (USD); Case/Package: 0402; Case Code (Metric): 1005; Case Code (Imperial): 0402; Min Operating Temperature: -55°C; Max Operating Temperature: 155°C; Package Quantity: 10000; Tolerance: 5%; Packaging: Tape and Reel; Composition: Thick Film; Number of Terminations: 2; Termination: SMD/SMT; Military Standard: Not; Working Voltage: 50V; Features: Moisture Resistant; Length: 1mm; Height: 0.016inch; Width: 0.02inch; Depth: 0.5mm; REACH SVHC: No SVHC; Lead Free: Lead Free; ComponentLink1URL: http://www.yageo.com/documents/recent/PYu-RC_Group_51_RoHS_L_10.pdf?src-supplier=Digi-Key; ComponentLink1Description: http://www.yageo.com/documents/recent/PYu-RC_Group_51_RoHS_L_10.pdf?src-supplier=Digi-Key; ComponentLink2URL: http://www.farnell.com/datasheets/2167052.pdf?src-supplier=Element14; ComponentLink2Description: http://www.farnell.com/datasheets/2167052.pdf?src-supplier=Element14; ComponentLink3URL: http://www.yageo.com/documents/recent/PYu-RC_Group_51_RoHS_L_9.pdf?src-supplier=Digi-Key; ComponentLink3Description: http://www.yageo.com/documents/recent/PYu-RC_Group_51_RoHS_L_9.pdf?src-supplier=Digi-Key; ComponentLink4URL: http://www.mouser.com/ds/2/447/PYu-RC0402_51_RoHS_L_6_r-8721.pdf?src-supplier=Mouser; ComponentLink4Description: http://www.mouser.com/ds/2/447/PYu-RC0402_51_RoHS_L_6_r-8721.pdf?src-supplier=Mouser; Supplier Part Number 1: 311-470KJRDKR-ND
SW1 SW2 = PTS810SJK250SMTRLFS: Manufacturer: ITT C&K; Mechanical Life: 50000Cycles; Throw Configuration: SPST; Operating Force: 260gf; Max Current Rating: 50mA; Illumination Type: Non-Illuminated; Switch Travel: 0.15mm; Switch Function: Off-Mom; Actuator Type: Standard; Supplier 1: Digi-Key; Manufacturer Part Number: PTS810SJK250SMTRLFS; Stock 1: 40646; Pricing 1: 1=0.3, 10=0.287, 25=0.2768, 50=0.267, 100=0.2521, 250=0.23728, 500=0.2274, 1000=0.17302 (USD); Mount: Surface Mount; Case/Package: SMD/SMT; Color: White; Contact Plating: Silver; Min Operating Temperature: -40°C; Max Operating Temperature: 85°C; Packaging: Tape and Reel; Current Rating: 50mA; Voltage Rating (DC): 16V; Package Quantity: 2900; Termination: J-Bend; Orientation: Straight; Length: 3.2mm; Depth: 4.6mm; Lead Free: Lead Free; ComponentLink1URL: https://www.ckswitches.com/media/1476/pts810.pdf?src-supplier=Digi-Key; ComponentLink1Description: https://www.ckswitches.com/media/1476/pts810.pdf?src-supplier=Digi-Key; Supplier Part Number 1: CKN10503DKR-ND
SW3 = 450404015514: MINI SPDT SLIDE SWITCH 6.7 X 2.7 MM / PINS 4-9 ARE MOUNTING; Manufacturer: Wurth Electronics; Supplier 1: Digi-Key; Manufacturer Part Number: 450404015514; Stock 1: 2610; Pricing 1: 1=0.75, 25=0.7212, 50=0.688, 250=0.622, 1500=0.5461 (USD); Supplier Part Number 1: 732-13665-6-ND; ComponentLink1Description: digikey; ComponentLink1URL: https://www.digikey.ca/product-detail/en/w-rth-elektronik/450404015514/732-13665-1-ND/9950835
U1 = ADS1299IPAGR: IC AFE 24BIT 16KSPS LN 64TQFP; Manufacturer: Texas Instruments; Max Supply Voltage: 5.25V; Max Power Dissipation: 42mW; Interface: SPI; Number of Bits: 24; Number of Channels: 8; Resolution: 24b; Sampling Rate: 16KS/s; Operating Supply Current: 7.14mA; Signal to Noise Ratio (SNR): 121dB; Power Consumption: 41mW; Supplier 1: Digi-Key; Manufacturer Part Number: ADS1299IPAGR; Stock 1: 1589; Pricing 1: 1=53.84, 10=50.577, 100=44.051 (USD); Case/Package: TQFP; Number of Pins: 64; Contact Plating: Gold; Min Operating Temperature: -40°C; Max Operating Temperature: 85°C; Package Quantity: 1; Packaging: Tape and Reel; Number of Converters: 8; Conversion Rate: 16KS/s; Number of Inputs: 8; Number of A/D Converters: 8; Type: General Purpose; Radiation Hardening: No; Lead Free: Lead Free; ComponentLink1URL: http://www.ti.com/lit/ds/symlink/ads1299.pdf?src-supplier=Digi-Key; ComponentLink1Description: http://www.ti.com/lit/ds/symlink/ads1299.pdf?src-supplier=Digi-Key; ComponentLink2URL: http://www.ti.com/general/docs/lit/getliterature.tsp?genericPartNumber=ADS1299&&fileType=pdf&src-supplier=Avnet; ComponentLink2Description: http://www.ti.com/general/docs/lit/getliterature.tsp?genericPartNumber=ADS1299&&fileType=pdf&src-supplier=Avnet; ComponentLink3URL: https://www.verical.com/server-webapp/html/getDatasheet?partID=681922&src-supplier=Verical; ComponentLink3Description: https://www.verical.com/server-webapp/html/getDatasheet?partID=681922&src-supplier=Verical; ComponentLink4URL: http://www.ti.com/litv/sbas499a?src-supplier=Mouser; ComponentLink4Description: http://www.ti.com/litv/sbas499a?src-supplier=Mouser; ComponentLink5URL: http://www.produktinfo.conrad.com/datenblaetter/1100000-1199999/001186463-da-01-en-IC_AFE_24BIT_16_ADS1299IPAGR_TQFP_64_TID.pdf?src-supplier=Conrad; ComponentLink5Description: http://www.produktinfo.conrad.com/datenblaetter/1100000-1199999/001186463-da-01-en-IC_AFE_24BIT_16_ADS1299IPAGR_TQFP_64_TID.pdf?src-supplier=Conrad; Supplier Part Number 1: 296-34818-6-ND; Category: Data Acquisition - Analog Front End (AFE)
U2 = AP3417CKTR-G1: IC REG BUCK ADJ 1A SYNC SOT25; Manufacturer: Diodes; Number of Outputs: 1; Min Input Voltage: 2.5V; Max Input Voltage: 5.5V; Efficiency: 94%; Min Output Voltage: 600mV; Max Output Voltage: 4.95V; Switching Frequency: 1.5MHz; Synchronous Rectifier: Yes; Output Voltage: 5V; Operating Supply Current: 220uA; Output Type: Adjustable; Output Configuration: Positive; Supplier 1: Digi-Key; Manufacturer Part Number: AP3417CKTR-G1; Stock 1: 30373; Pricing 1: 1=0.41, 10=0.351, 100=0.2621, 500=0.20592, 1000=0.15912 (USD); Mount: Surface Mount; Case/Package: SOT-23-5; Number of Pins: 5; Weight: 0.001058oz; Min Operating Temperature: -40°C; Max Operating Temperature: 85°C; Package Quantity: 3000; Packaging: Tape and Reel; Max Output Current: 1A; Output Current: 1A; Min Supply Voltage: 2.5V; Operating Supply Voltage: 5.5V; Length: 3.1mm; Height: 1.3mm; Width: 1.7mm; Lead Free: Lead Free; ComponentLink1URL: https://www.diodes.com/assets/Datasheets/AP3417C.pdf?src-supplier=Digi-Key; ComponentLink1Description: https://www.diodes.com/assets/Datasheets/AP3417C.pdf?src-supplier=Digi-Key; ComponentLink2URL: http://www.diodes.com/datasheets/AP3417C.pdf?src-supplier=Avnet; ComponentLink2Description: http://www.diodes.com/datasheets/AP3417C.pdf?src-supplier=Avnet; Supplier Part Number 1: AP3417CKTR-G1DIDKR-ND
U3 U6 U9 = EXB-N8V162JX: Manufacturer: Panasonic; Tolerance: 5%; Voltage Rating: 50V; Resistance: 1.6kR; Circuit Type: Isolated; Number of Resistors: 4; Power Per Element: 31mW; Temperature Coefficient: 200ppm/°C; Number of Contacts: 8; Voltage Rating (DC): 100V; Supplier 1: Digi-Key; Manufacturer Part Number: EXB-N8V162JX; Stock 1: 21369; Pricing 1: 1=0.11, 10=0.094, 25=0.0652, 50=0.0508, 100=0.0363, 250=0.02832, 500=0.0225, 1000=0.01597, 5000=0.01234 (USD); Mount: Surface Mount; Case/Package: 0402; Number of Pins: 8; Number of Terminals: 8; Min Operating Temperature: -55°C; Max Operating Temperature: 125°C; Packaging: Tape and Reel; Package Quantity: 1; Termination: SMD/SMT; Length: 0.079inch; Height: 0.022inch; Width: 1mm; Terminal Pitch: 0.5mm; Radiation Hardening: No; Lead Free: Contains Lead; ComponentLink1URL: http://www.mouser.com/ds/2/315/AOC0000CE1-49292.pdf?src-supplier=Mouser; ComponentLink1Description: http://www.mouser.com/ds/2/315/AOC0000CE1-49292.pdf?src-supplier=Mouser; ComponentLink2URL: http://industrial.panasonic.com/www-data/pdf/AOC0000/AOC0000CE1.pdf?src-supplier=Avnet; ComponentLink2Description: http://industrial.panasonic.com/www-data/pdf/AOC0000/AOC0000CE1.pdf?src-supplier=Avnet; ComponentLink3URL: http://www.onlinecomponents.com/datasheet/exb-n8v162jx.aspx?p=44463680&src-supplier=Onlinecomponents.com; ComponentLink3Description: http://www.onlinecomponents.com/datasheet/exb-n8v162jx.aspx?p=44463680&src-supplier=Onlinecomponents.com; ComponentLink4URL: https://industrial.panasonic.com/cdbs/www-data/pdf/AOC0000/AOC0000C14.pdf?src-supplier=Digi-Key; ComponentLink4Description: https://industrial.panasonic.com/cdbs/www-data/pdf/AOC0000/AOC0000C14.pdf?src-supplier=Digi-Key; Supplier Part Number 1: Y10162DKR-ND
U4 = TPS61073DDCR: IC REG BOOST ADJ 0.5A SYNC SOT6; Manufacturer: Texas Instruments; Output Voltage: 5.5V; Number of Outputs: 1; Max Output Current: 150mA; Min Input Voltage: 900mV; Efficiency: 90%; Frequency: 1.2MHz; Min Supply Voltage: 2.3V; Synchronous Rectifier: Yes; Quiescent Current: 19uA; Output Type: Adjustable; Output Configuration: Positive; Supplier 1: Digi-Key; Manufacturer Part Number: TPS61073DDCR; Stock 1: 6000; Pricing 1: 3000=0.52668, 6000=0.50688, 15000=0.49104 (USD); Mount: Surface Mount; Case/Package: SOT-23-6; Number of Pins: 6; Weight: 0.00127oz; Min Operating Temperature: -40°C; Max Operating Temperature: 85°C; Packaging: Tape and Reel; Max Input Voltage: 5.5V; Output Current: 150mA; Max Supply Voltage: 5.5V; Package Quantity: 1; Switching Frequency: 1.2MHz; Min Output Voltage: 2.3V; Max Output Voltage: 5.5V; Termination: SMD/SMT; Topology: Boost; REACH SVHC: No SVHC; Lead Free: Lead Free; ComponentLink1URL: http://focus.ti.com/lit/ds/symlink/tps61070.pdf?src-supplier=Element14; ComponentLink1Description: http://focus.ti.com/lit/ds/symlink/tps61070.pdf?src-supplier=Element14; ComponentLink2URL: http://www.ti.com/lit/ds/symlink/tps61073.pdf?src-supplier=Digi-Key; ComponentLink2Description: http://www.ti.com/lit/ds/symlink/tps61073.pdf?src-supplier=Digi-Key; Supplier Part Number 1: 296-21898-2-ND; Category: PMIC - Voltage Regulators - DC DC Switching Regulators
U5 U7 = CA0612KRX7R9BB102: YAGEO (PHYCOMP)         CA0612KRX7R9BB102             Capacitor Array, C-Array, 1000 pF, 50 V,  10%, SMD, 4 Element; Dielectric Material: Ceramic; Capacitance: 1nF; Number of Elements: 4; Circuit Type: Isolated; Dissipation Factor: 2.5%; Insulation Resistance: 10GR; Supplier 1: Digi-Key; Manufacturer: Yageo; Manufacturer Part Number: CA0612KRX7R9BB102; Stock 1: 2369; Pricing 1: 1=0.41, 10=0.283, 100=0.1697, 500=0.12728, 1000=0.10749 (USD); Mount: Surface Mount; Case/Package: 0612; Case Code (Metric): 1632; Case Code (Imperial): 0612; Number of Terminals: 8; Min Operating Temperature: -55°C; Max Operating Temperature: 125°C; Tolerance: 10%; Voltage Rating: 50V; Packaging: Tape and Reel; Package Quantity: 4000; Dielectric: X7R; Number of Capacitors: 4; Termination: SMD/SMT; Composition: Ceramic; Voltage: 50V; Length: 3.2mm; Height: 0.8mm; Width: 0.063inch; Height - Seated (Max): 0.035inch; Terminal Pitch: 0.8mm; Depth: 3.2mm; Radiation Hardening: No; REACH SVHC: Unknown; Lead Free: Lead Free; ComponentLink1URL: https://www.verical.com/server-webapp/html/getDatasheet?partID=403419&src-supplier=Verical; ComponentLink1Description: https://www.verical.com/server-webapp/html/getDatasheet?partID=403419&src-supplier=Verical; ComponentLink2URL: http://www.yageo.com/documents/recent/UPY-4C-Array_16V-to-50V-3.pdf?src-supplier=Digi-Key; ComponentLink2Description: http://www.yageo.com/documents/recent/UPY-4C-Array_16V-to-50V-3.pdf?src-supplier=Digi-Key; ComponentLink3URL: http://www.farnell.com/datasheets/2167451.pdf?src-supplier=Element14; ComponentLink3Description: http://www.farnell.com/datasheets/2167451.pdf?src-supplier=Element14; ComponentLink4URL: http://www.yageo.com/documents/recent/UPY-4C-Array_16V-to-50V_4.pdf?src-supplier=Future+Electronics; ComponentLink4Description: http://www.yageo.com/documents/recent/UPY-4C-Array_16V-to-50V_4.pdf?src-supplier=Future+Electronics; Supplier Part Number 1: 311-2073-6-ND
U8 = PIC32MX250F128B-I/SS: MICROCHIP - PIC32MX250F128B-I/SS - MCU, 32BIT, PIC32, 40MHZ, SSOP-28; Number of Timers/Counters: 5; Number of ADC Channels: 10; RAM Size: 32KB; Interface: I2C,SPI,USB,IrDA,UART,USART,LIN,I2S; Number of I/Os: 19; Max Supply Voltage: 3.6V; Min Supply Voltage: 2.3V; Number of UART Channels: 2; Data Bus Width: 32b; Oscillator Type: Internal; Watchdog Timer: Yes; Memory Type: FLASH; Memory Size: 128KB; Peripherals: I2C,Brown-out Detect/Reset,POR,PWM,WDT,DMA; Core Architecture: PIC; Supplier 1: Digi-Key; Manufacturer: Microchip; Manufacturer Part Number: PIC32MX250F128B-I/SS; Stock 1: 861; Pricing 1: 1=3.57, 25=3.27, 100=2.96 (USD); Case/Package: SSOP; Number of Pins: 28; Min Operating Temperature: -40°C; Max Operating Temperature: 85°C; Packaging: Rail/Tube; Package Quantity: 47; Frequency: 40MHz; Number of PWM Channels: 5; Number of Programmable I/O: 19; Max Frequency: 40MHz; Number of SPI Channels: 2; Number of I2C Channels: 2; Address Bus Width: 32b; Length: 10.5mm; Height: 1.85mm; Width: 5.6mm; Radiation Hardening: No; REACH SVHC: No SVHC; Lead Free: Lead Free; ComponentLink1URL: https://www.distrelec.biz/Web/Downloads/_t/ds/PIC32MX1XX_2XX_eng_tds.pdf?mime=application%2Fpdf&src-supplier=Distrelec; ComponentLink1Description: https://www.distrelec.biz/Web/Downloads/_t/ds/PIC32MX1XX_2XX_eng_tds.pdf?mime=application%2Fpdf&src-supplier=Distrelec; ComponentLink2URL: http://uk.rs-online.com/webdocs/1385/0900766b8138557c.pdf?src-supplier=RSComponents; ComponentLink2Description: http://uk.rs-online.com/webdocs/1385/0900766b8138557c.pdf?src-supplier=RSComponents; ComponentLink3URL: http://www.microchip.com/mymicrochip/filehandler.aspx?ddocname=en556114&src-supplier=Digi-Key; ComponentLink3Description: http://www.microchip.com/mymicrochip/filehandler.aspx?ddocname=en556114&src-supplier=Digi-Key; ComponentLink4URL: http://ww1.microchip.com/downloads/en/DeviceDoc/61168D.pdf?src-supplier=Avnet; ComponentLink4Description: http://ww1.microchip.com/downloads/en/DeviceDoc/61168D.pdf?src-supplier=Avnet; ComponentLink5URL: http://www.farnell.com/datasheets/1538023.pdf?src-supplier=Element14; ComponentLink5Description: http://www.farnell.com/datasheets/1538023.pdf?src-supplier=Element14; Supplier Part Number 1: PIC32MX250F128B-I/SS-ND